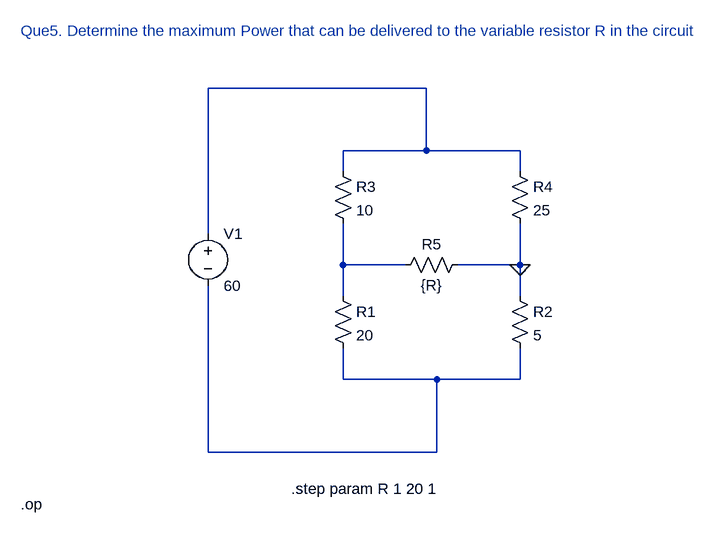
[diagram p0: schematic 5_Dheerendra_23EE019_Power_Transfer.asc]
5_Dheerendra_23EE019_Power_Transfer.asc, the LTspice schematic file:
Version 4
SHEET 1 880 680
WIRE 304 -224 -32 -224
WIRE 304 -128 304 -224
WIRE 304 -128 176 -128
WIRE 448 -128 304 -128
WIRE 176 -96 176 -128
WIRE 448 -96 448 -128
WIRE -32 0 -32 -224
WIRE 176 48 176 -16
WIRE 272 48 176 48
WIRE 448 48 448 -16
WIRE 448 48 352 48
WIRE 176 96 176 48
WIRE 448 96 448 48
WIRE 176 224 176 176
WIRE 320 224 176 224
WIRE 448 224 448 176
WIRE 448 224 320 224
WIRE -32 336 -32 80
WIRE 320 336 320 224
WIRE 320 336 -32 336
FLAG 448 48 0
SYMBOL res 160 80 R0
SYMATTR InstName R1
SYMATTR Value 20
SYMBOL res 432 80 R0
SYMATTR InstName R2
SYMATTR Value 5
SYMBOL res 160 -112 R0
SYMATTR InstName R3
SYMATTR Value 10
SYMBOL res 432 -112 R0
SYMATTR InstName R4
SYMATTR Value 25
SYMBOL res 368 32 R90
WINDOW 0 0 56 VBottom 2
WINDOW 3 32 56 VTop 2
SYMATTR InstName R5
SYMATTR Value {R}
SYMBOL voltage -32 -16 R0
WINDOW 123 0 0 Left 0
WINDOW 39 0 0 Left 0
SYMATTR InstName V1
SYMATTR Value 60
TEXT -320 -312 Left 2 ;Que5. Determine the maximum Power that can be delivered to the variable resistor R in the circuit
TEXT 96 392 Left 2 !.step param R 1 20 1
TEXT -320 416 Left 2 !.op

The netlist it stands for:
* 5_Dheerendra_23EE019_Power_Transfer.asc
R1 N002 N003 20
R2 0 N003 5
R3 N001 N002 10
R4 N001 0 25
R5 0 N002 {R}
V1 N001 N003 60
* Que5. Determine the maximum Power that can be delivered to the variable resistor R in the circuit
.step param R 1 20 1
.op
.backanno
.end